# Altium schematic sheet Button_Block.SchDoc
size A4; CheckedBy: CT-Energys; Author: CT-Energys; CompanyName: HTD COMPANY LIMITED; DrawnBy: CHITOAN; Engineer: CHITOAN; Organization: Altium Limited; Address1: HO CHI MINH CITY; Address2: VIETNAM
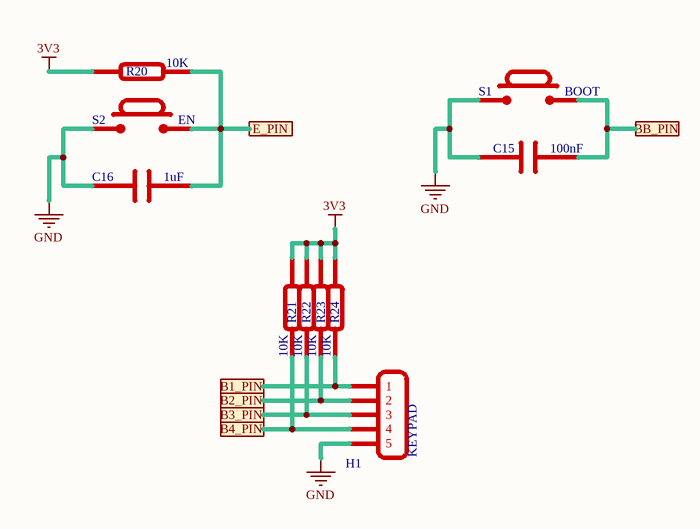
[diagram p0: Button_Block.SchDoc]

## Parts
C15  100nF  [C0603]
C16  1uF  [C0603]
H1  KEYPAD  [XH-2.54-5P]
R20  10K  [R0603]
R21  10K  [R0603]
R22  10K  [R0603]
R23  10K  [R0603]
R24  10K  [R0603]
S1  BOOT  [BTN-SMD-3x6]
S2  EN  [BTN-SMD-3x6]

## Ports
B1_PIN, B2_PIN, B3_PIN, B4_PIN, BB_PIN, E_PIN

## Nets
3V3: R20.2 R21.1 R22.1 R23.1 R24.1
GND: C15.2 C16.2 H1.5 S1.1 S2.1
B1_PIN: H1.1 R24.2 ; port B1_PIN
B2_PIN: H1.2 R23.2 ; port B2_PIN
B3_PIN: H1.3 R22.2 ; port B3_PIN
B4_PIN: H1.4 R21.2 ; port B4_PIN
BB_PIN: C15.1 S1.2 ; port BB_PIN
E_PIN: C16.1 R20.1 S2.2 ; port E_PIN

## Notes on the sheet
- Title
- Size:
- Date:
- A4
- Number:
- Time:
- Revision:
- Design by:
- Company:
- File:

## Library data of the parts
C15 C16 = CAP-CER: Ceramic Capacitor
H1 = CONN-5P: Connector 5 Pole
R20-R24 = Resistor
S1 S2 = Button-2P: Tactile Switch 2 pole